# EAGLE design base1 (EAGLE 7.2.0)
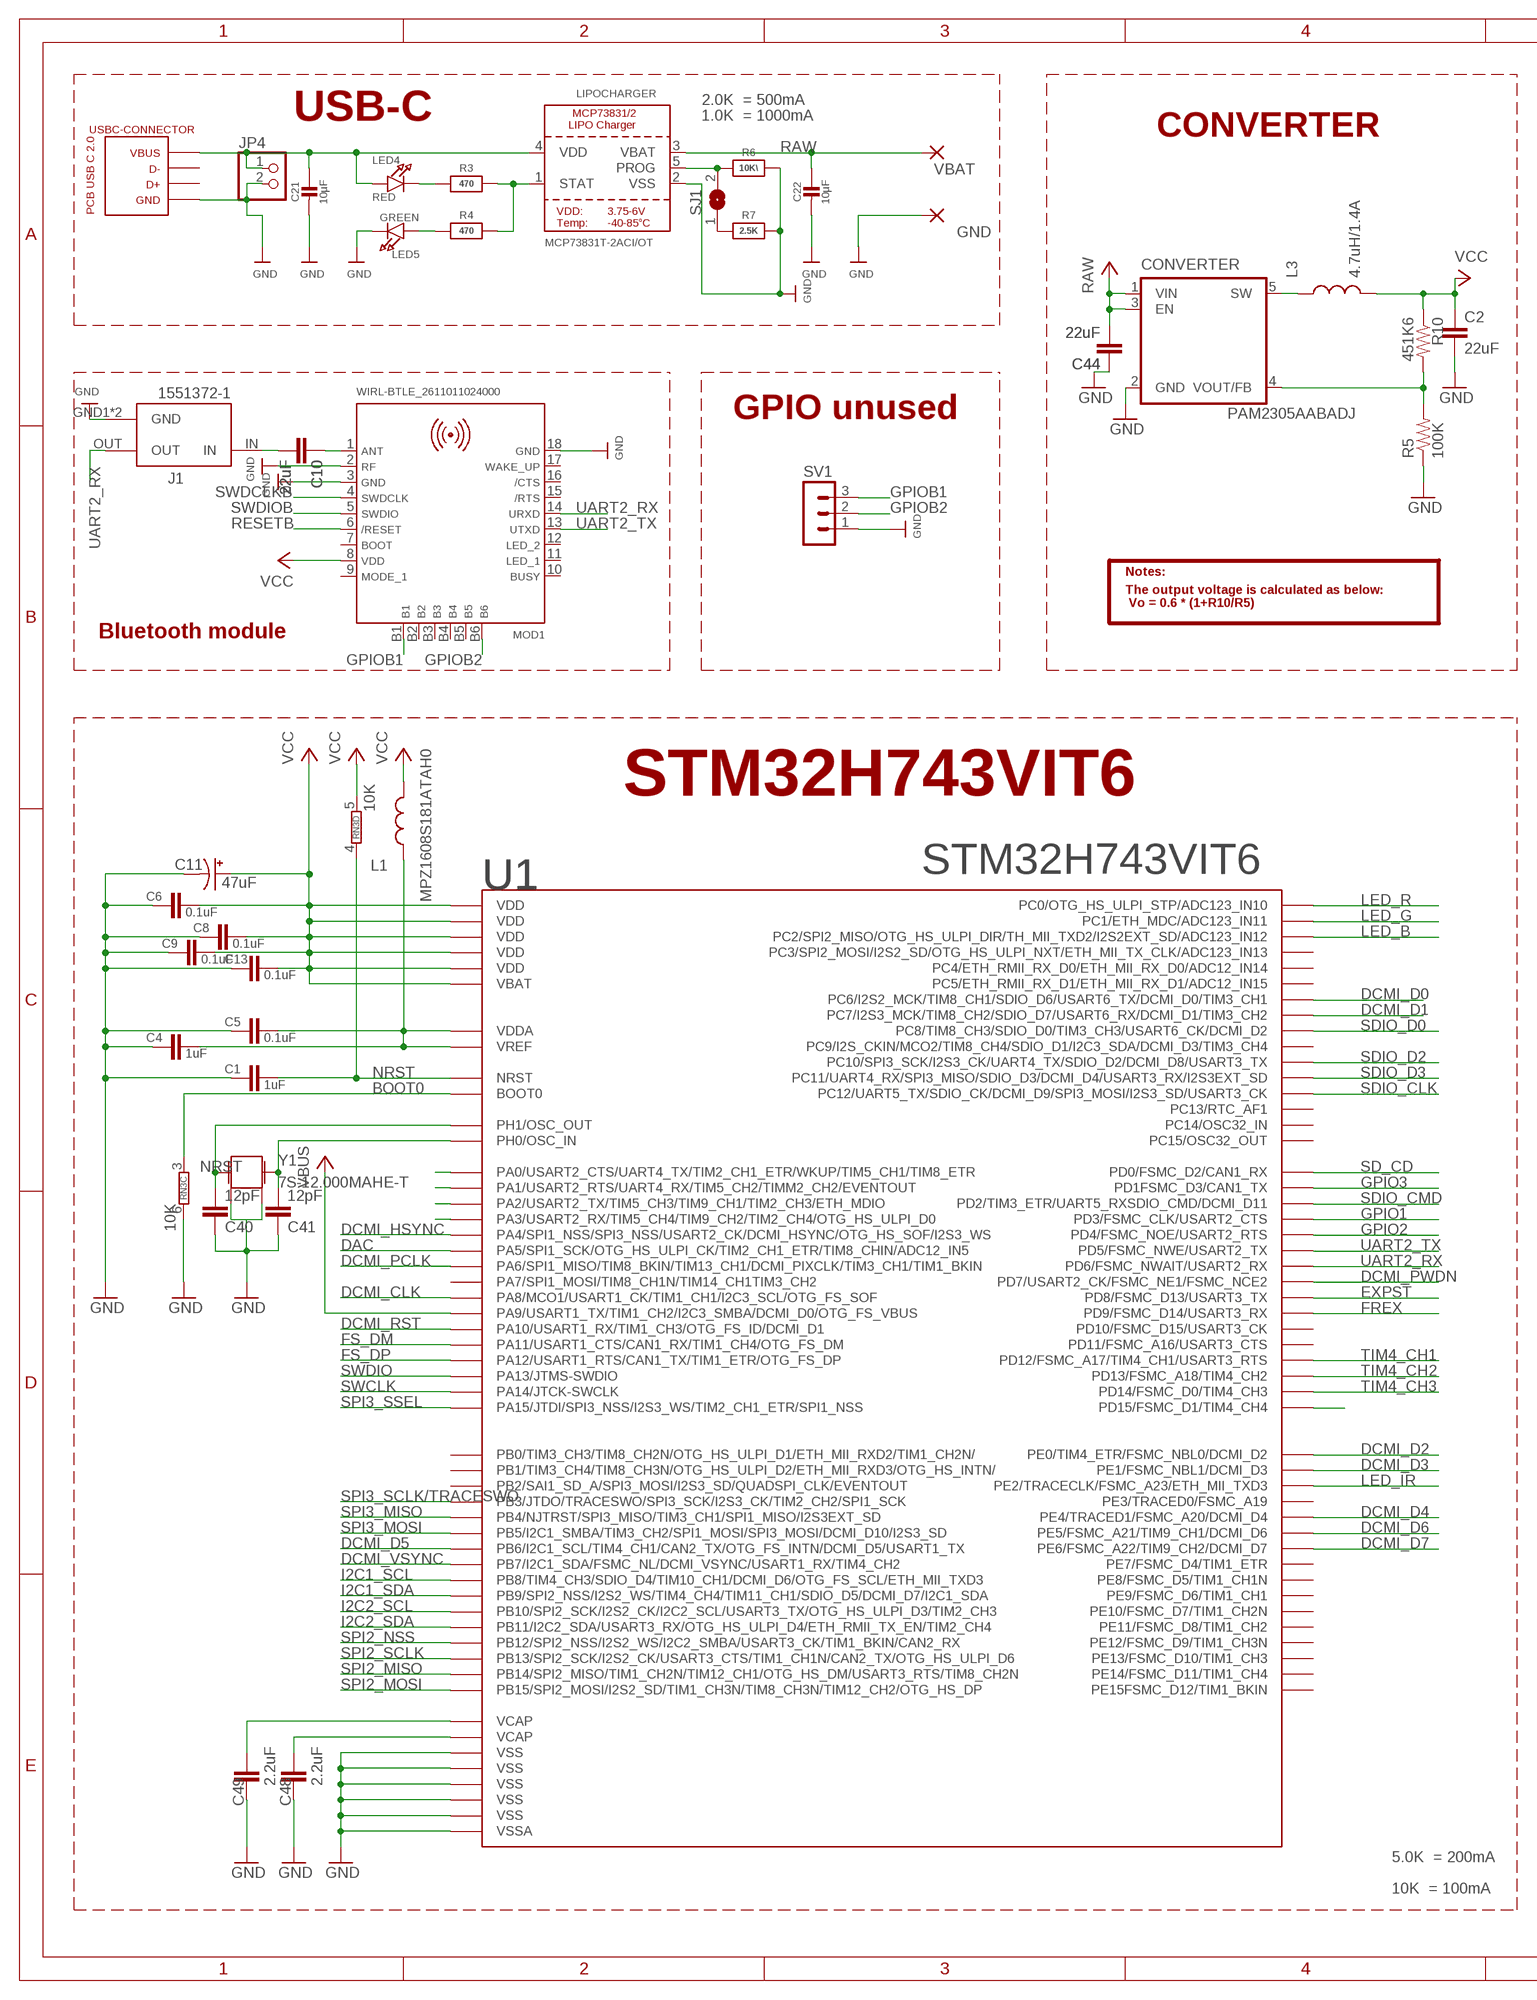
[diagram p0: schematic, sheet 1, part 1 of 2]
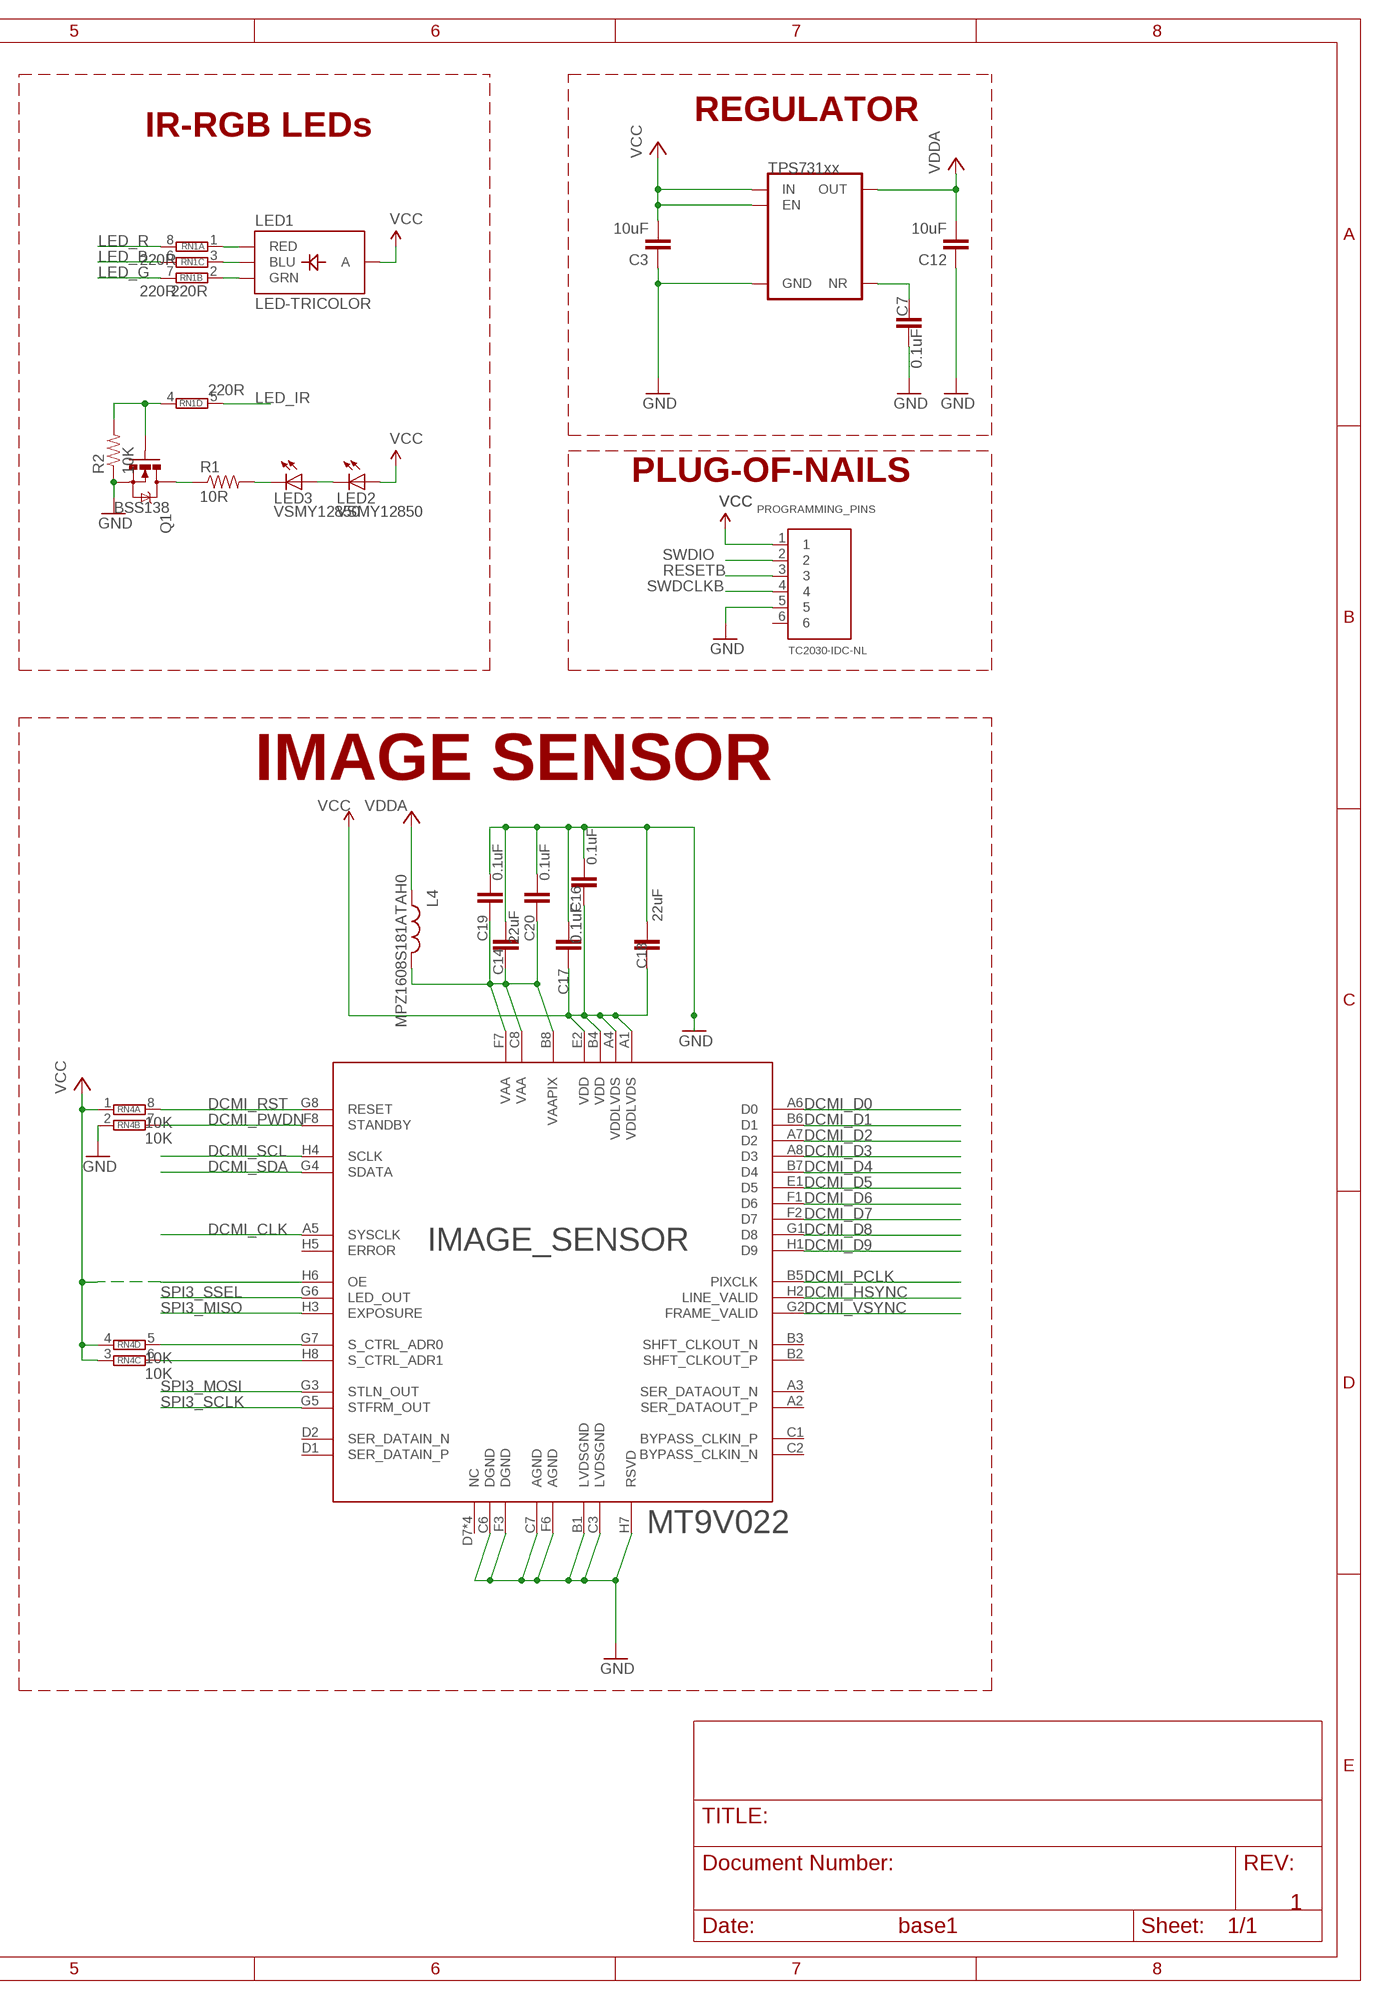
[diagram p1: schematic, sheet 1, part 2 of 2]

## Parts
C1  1uF  CAP0603-CAP  [0603-CAP]
C2  22uF  CAP0805  [0805]
C3  10uF  CAP0805  [0805]
C4  1uF  CAP0603-CAP  [0603-CAP]
C5  0.1uF  CAP0603-CAP  [0603-CAP]
C6  0.1uF  CAP0603-CAP  [0603-CAP]
C7  0.1uF  CAP0603-CAP  [0603-CAP]
C8  0.1uF  CAP0603-CAP  [0603-CAP]
C9  0.1uF  CAP0603-CAP  [0603-CAP]
C10  22uF  CAP0805  [0805]
C11  47uF  CAP_POL1206  [EIA3216]
C12  10uF  CAP0805  [0805]
C13  0.1uF  CAP0603-CAP  [0603-CAP]
C14  22uF  CAP0805  [0805]
C16  0.1uF  CAP0402-CAP  [0402-CAP]
C17  0.1uF  CAP0402-CAP  [0402-CAP]
C18  22uF  CAP0805  [0805]
C19  0.1uF  CAP0402-CAP  [0402-CAP]
C20  0.1uF  CAP0402-CAP  [0402-CAP]
C21  10µF  CAP_CERAMIC0805-NOOUTLINE  [0805-NO]
C22  10µF  CAP_CERAMIC0805-NOOUTLINE  [0805-NO]
C40  12pF  CAP0603-CAP  [0603-CAP]
C41  12pF  CAP0603-CAP  [0603-CAP]
C44  22uF  CAP0805  [0805]
C48  2.2uF  CAP0603-CAP  [0603-CAP]
C49  2.2uF  CAP0603-CAP  [0603-CAP]
CONVERTER  PAM2305AABADJ  PAM2305AAB330  [TSOT25]
GND  SMD2  [SMD1,27-2,54]
IMAGE_SENSOR  MT9V022  [IBGA52]
J1  1551372-1  [TE_1551372-1]
JP4  HEADER-1X2ROUND  [1X02_ROUND]
L1  MPZ1608S181ATAH0  INDUCTOR0603  [0603]
L3  4.7uH/1.4A  INDUCTOR1007  [1007]
L4  MPZ1608S181ATAH0  INDUCTOR0603  [0603]
LED1  LED-TRICOLOR  [LED-TRICOLOR-SMD-MF]
LED2  VSMY12850  LED1206  [LED-1206]
LED3  VSMY12850  LED1206  [LED-1206]
LED4  RED  LED0805_NOOUTLINE  [CHIPLED_0805_NOOUTLINE]
LED5  GREEN  LED0805_NOOUTLINE  [CHIPLED_0805_NOOUTLINE]
LIPOCHARGER  MCP73831T-2ACI/OT  MCP73831/2  [SOT23-5]
MOD1  WIRL-BTLE_2611011024000  [WE-FP-4+]
PROGRAMMING_PINS  TC2030-IDC-NL  [TAG_TC2030-IDC-NL]
Q1  BSS138  MOSFET-NCHANNELSMD  [SOT23-3]
R1  10R  RESISTOR0603-RES  [0603-RES]
R2  10K  RESISTOR0603-RES  [0603-RES]
R3  470  RESISTOR0805_NOOUTLINE  [0805-NO]
R4  470  RESISTOR0805_NOOUTLINE  [0805-NO]
R5  100K  RESISTOR0603-RES  [0603-RES]
R6  10K\  RESISTOR0805_NOOUTLINE  [0805-NO]
R7  2.5K  RESISTOR0805_NOOUTLINE  [0805-NO]
R10  451K6  RESISTOR0603-RES  [0603-RES]
REGULATOR  TPS731XX  [SOT23-5]
RN1  220R  4R-NEXBV8V  [EXBV8V]
RN3  10K  4R-NEXBV8V  [EXBV8V]
RN4  10K  4R-NEXBV8V  [EXBV8V]
SJ1  SOLDERJUMPER  [SOLDERJUMPER_ARROW_NOPASTE]
SV1  MA03-1  [MA03-1]
U1  STM32H743VIT6  STM32F746LQFP100  [LQFP100]
USBC-CONNECTOR  PCB_USB_C_2.0DS_2  [USB_TYPE_C_DS_2]
VBAT  SMD2  [SMD1,27-2,54]
Y1  7S-12.000MAHE-T  CRYSTAL2.5X2.0  [CRYSTAL-2.5X2.0]

## Nets
BOOT0: RN3.3 U1.94(BOOT0)
DAC: U1.29(PA5/SPI1_SCK/OTG_HS_ULPI_CK/TIM2_CH1_ETR/TIM8_CHIN/ADC12_IN5)
DCMI_CLK: IMAGE_SENSOR.A5(SYSCLK) U1.67(PA8/MCO1/USART1_CK/TIM1_CH1/I2C3_SCL/OTG_FS_SOF)
DCMI_D0: IMAGE_SENSOR.A6(D0) U1.63(PC6/I2S2_MCK/TIM8_CH1/SDIO_D6/USART6_TX/DCMI_D0/TIM3_CH1)
DCMI_D1: IMAGE_SENSOR.B6(D1) U1.64(PC7/I2S3_MCK/TIM8_CH2/SDIO_D7/USART6_RX/DCMI_D1/TIM3_CH2)
DCMI_D2: IMAGE_SENSOR.A7(D2) U1.97(PE0/TIM4_ETR/FSMC_NBL0/DCMI_D2)
DCMI_D3: IMAGE_SENSOR.A8(D3) U1.98(PE1/FSMC_NBL1/DCMI_D3)
DCMI_D4: IMAGE_SENSOR.B7(D4) U1.3(PE4/TRACED1/FSMC_A20/DCMI_D4)
DCMI_D5: IMAGE_SENSOR.E1(D5) U1.92(PB6/I2C1_SCL/TIM4_CH1/CAN2_TX/OTG_FS_INTN/DCMI_D5/USART1_TX)
DCMI_D6: IMAGE_SENSOR.F1(D6) U1.4(PE5/FSMC_A21/TIM9_CH1/DCMI_D6)
DCMI_D7: IMAGE_SENSOR.F2(D7) U1.5(PE6/FSMC_A22/TIM9_CH2/DCMI_D7)
DCMI_D8: IMAGE_SENSOR.G1(D8)
DCMI_D9: IMAGE_SENSOR.H1(D9)
DCMI_HSYNC: IMAGE_SENSOR.H2(LINE_VALID) U1.28(PA4/SPI1_NSS/SPI3_NSS/USART2_CK/DCMI_HSYNC/OTG_HS_SOF/I2S3_WS)
DCMI_PCLK: IMAGE_SENSOR.B5(PIXCLK) U1.30(PA6/SPI1_MISO/TIM8_BKIN/TIM13_CH1/DCMI_PIXCLK/TIM3_CH1/TIM1_BKIN)
DCMI_PWDN: IMAGE_SENSOR.F8(STANDBY) RN4.7 U1.88(PD7/USART2_CK/FSMC_NE1/FSMC_NCE2)
DCMI_RST: IMAGE_SENSOR.G8(RESET) RN4.8 U1.69(PA10/USART1_RX/TIM1_CH3/OTG_FS_ID/DCMI_D1)
DCMI_SCL: IMAGE_SENSOR.H4(SCLK)
DCMI_SDA: IMAGE_SENSOR.G4(SDATA)
DCMI_VSYNC: IMAGE_SENSOR.G2(FRAME_VALID) U1.93(PB7/I2C1_SDA/FSMC_NL/DCMI_VSYNC/USART1_RX/TIM4_CH2)
EXPST: U1.55(PD8/FSMC_D13/USART3_TX)
FREX: U1.56(PD9/FSMC_D14/USART3_RX)
FS_DM: U1.70(PA11/USART1_CTS/CAN1_RX/TIM1_CH4/OTG_FS_DM)
FS_DP: U1.71(PA12/USART1_RTS/CAN1_TX/TIM1_ETR/OTG_FS_DP)
GND: C1.2 C2.2 C3.1 C4.2 C5.2 C6.2 C7.2 C8.2 C9.2 C11.C(-) C12.1 C13.2 C14.1 C16.2 C17.2 C18.1 C19.2 C20.2 C21.2 C22.2 C40.1 C41.1 C44.1 C48.2 C49.2 CONVERTER.2(GND) GND.1(P) IMAGE_SENSOR.B1(LVDSGND) IMAGE_SENSOR.C3(LVDSGND) IMAGE_SENSOR.C6(DGND) IMAGE_SENSOR.C7(AGND) IMAGE_SENSOR.F3(DGND) IMAGE_SENSOR.F6(AGND) IMAGE_SENSOR.H7(RSVD) J1.GND1(GND) J1.GND2(GND) JP4.2 LED5.C LIPOCHARGER.2(VSS) MOD1.2 MOD1.3 MOD1.18 PROGRAMMING_PINS.5 Q1.2(S) R2.1 R5.1 R6.2 R7.2 REGULATOR.2(GND) RN3.6 RN4.2 SV1.1 U1.10(VSS) U1.19(VSSA) U1.26(VSS) U1.49(VSS) U1.74(VSS) U1.99(VSS) USBC-CONNECTOR.A4(VBUS) USBC-CONNECTOR.A9(VBUS) USBC-CONNECTOR.B4(VBUS) USBC-CONNECTOR.B9(VBUS)
GPIO1: U1.84(PD3/FSMC_CLK/USART2_CTS)
GPIO2: U1.85(PD4/FSMC_NOE/USART2_RTS)
GPIO3: U1.82(PD1FSMC_D3/CAN1_TX)
GPIOB1: MOD1.B1 SV1.3
GPIOB2: MOD1.B6 SV1.2
I2C1_SCL: U1.95(PB8/TIM4_CH3/SDIO_D4/TIM10_CH1/DCMI_D6/OTG_FS_SCL/ETH_MII_TXD3)
I2C1_SDA: U1.96(PB9/SPI2_NSS/I2S2_WS/TIM4_CH4/TIM11_CH1/SDIO_D5/DCMI_D7/I2C1_SDA)
I2C2_SCL: U1.46(PB10/SPI2_SCK/I2S2_CK/I2C2_SCL/USART3_TX/OTG_HS_ULPI_D3/TIM2_CH3)
I2C2_SDA: U1.47(PB11/I2C2_SDA/USART3_RX/OTG_HS_ULPI_D4/ETH_RMII_TX_EN/TIM2_CH4)
LED_B: RN1.6 U1.17(PC2/SPI2_MISO/OTG_HS_ULPI_DIR/TH_MII_TXD2/I2S2EXT_SD/ADC123_IN12)
LED_G: RN1.7 U1.16(PC1/ETH_MDC/ADC123_IN11)
LED_IR: RN1.5 U1.1(PE2/TRACECLK/FSMC_A23/ETH_MII_TXD3)
LED_R: RN1.8 U1.15(PC0/OTG_HS_ULPI_STP/ADC123_IN10)
N$1: LED4.C R3.1
N$2: C40.2 U1.13(PH1/OSC_OUT) Y1.3
N$3: LIPOCHARGER.1(STAT) R3.2 R4.2
N$4: C41.2 U1.12(PH0/OSC_IN) Y1.1
N$5: Q1.1(G) R2.2 RN1.4
N$6: LED1.B(BLU) RN1.3
N$7: C10.2 J1.IN
N$8: LED1.R(RED) RN1.1
N$9: LED1.G(GRN) RN1.2
N$10: LED3.C R1.2
N$11: C7.1 REGULATOR.4(NR)
N$12: C4.1 C5.1 L1.1 U1.20(VREF) U1.21(VDDA)
N$13: CONVERTER.4(VOUT/FB) R5.2 R10.2
N$14: Q1.3(D) R1.1
N$15: LIPOCHARGER.5(PROG) R6.1 SJ1.2
N$16: LED5.A R4.1
N$17: LED2.C LED3.A
N$18: R7.1 SJ1.1
N$19: IMAGE_SENSOR.G7(S_CTRL_ADR0) RN4.5
N$20: IMAGE_SENSOR.H8(S_CTRL_ADR1) RN4.6
N$21: C10.1 MOD1.1
N$30: U1.62(PD15/FSMC_D1/TIM4_CH4)
N$31: U1.22(PA0/USART2_CTS/UART4_TX/TIM2_CH1_ETR/WKUP/TIM5_CH1/TIM8_ETR)
N$32: U1.23(PA1/USART2_RTS/UART4_RX/TIM5_CH2/TIMM2_CH2/EVENTOUT)
N$33: U1.24(PA2/USART2_TX/TIM5_CH3/TIM9_CH1/TIM2_CH3/ETH_MDIO)
N$34: U1.25(PA3/USART2_RX/TIM5_CH4/TIM9_CH2/TIM2_CH4/OTG_HS_ULPI_D0)
NRST: C1.1 RN3.4 U1.14(NRST)
P$1: Y1.2 Y1.4
RAW: C22.1 C44.2 CONVERTER.1(VIN) CONVERTER.3(EN) LIPOCHARGER.3(VBAT) VBAT.1(P)
RESETB: MOD1.6 PROGRAMMING_PINS.3
SD_CD: U1.81(PD0/FSMC_D2/CAN1_RX)
SDIO_CLK: U1.80(PC12/UART5_TX/SDIO_CK/DCMI_D9/SPI3_MOSI/I2S3_SD/USART3_CK)
SDIO_CMD: U1.83(PD2/TIM3_ETR/UART5_RXSDIO_CMD/DCMI_D11)
SDIO_D0: U1.65(PC8/TIM8_CH3/SDIO_D0/TIM3_CH3/USART6_CK/DCMI_D2)
SDIO_D2: U1.78(PC10/SPI3_SCK/I2S3_CK/UART4_TX/SDIO_D2/DCMI_D8/USART3_TX)
SDIO_D3: U1.79(PC11/UART4_RX/SPI3_MISO/SDIO_D3/DCMI_D4/USART3_RX/I2S3EXT_SD)
SPI2_MISO: U1.53(PB14/SPI2_MISO/TIM1_CH2N/TIM12_CH1/OTG_HS_DM/USART3_RTS/TIM8_CH2N)
SPI2_MOSI: U1.54(PB15/SPI2_MOSI/I2S2_SD/TIM1_CH3N/TIM8_CH3N/TIM12_CH2/OTG_HS_DP)
SPI2_NSS: U1.51(PB12/SPI2_NSS/I2S2_WS/I2C2_SMBA/USART3_CK/TIM1_BKIN/CAN2_RX)
SPI2_SCLK: U1.52(PB13/SPI2_SCK/I2S2_CK/USART3_CTS/TIM1_CH1N/CAN2_TX/OTG_HS_ULPI_D6)
SPI3_MISO: IMAGE_SENSOR.H3(EXPOSURE) U1.90(PB4/NJTRST/SPI3_MISO/TIM3_CH1/SPI1_MISO/I2S3EXT_SD)
SPI3_MOSI: IMAGE_SENSOR.G3(STLN_OUT) U1.91(PB5/I2C1_SMBA/TIM3_CH2/SPI1_MOSI/SPI3_MOSI/DCMI_D10/I2S3_SD)
SPI3_SCLK: IMAGE_SENSOR.G5(STFRM_OUT)
SPI3_SCLK/TRACESWO: U1.89(PB3/JTDO/TRACESWO/SPI3_SCK/I2S3_CK/TIM2_CH2/SPI1_SCK)
SPI3_SSEL: IMAGE_SENSOR.G6(LED_OUT) U1.77(PA15/JTDI/SPI3_NSS/I2S3_WS/TIM2_CH1_ETR/SPI1_NSS)
SW: CONVERTER.5(SW) L3.1
SWCLK: U1.76(PA14/JTCK-SWCLK)
SWDCLKB: MOD1.4 PROGRAMMING_PINS.4
SWDIO: PROGRAMMING_PINS.2 U1.72(PA13/JTMS-SWDIO)
SWDIOB: MOD1.5
TIM4_CH1: U1.59(PD12/FSMC_A17/TIM4_CH1/USART3_RTS)
TIM4_CH2: U1.60(PD13/FSMC_A18/TIM4_CH2)
TIM4_CH3: U1.61(PD14/FSMC_D0/TIM4_CH3)
UART2_RX: J1.OUT MOD1.14 U1.87(PD6/FSMC_NWAIT/USART2_RX)
UART2_TX: MOD1.13 U1.86(PD5/FSMC_NWE/USART2_TX)
VAA: C14.2 C19.1 C20.1 IMAGE_SENSOR.B8(VAAPIX) IMAGE_SENSOR.C8(VAA) IMAGE_SENSOR.F7(VAA) L4.2
VBAT: C2.1 C3.2 C6.1 C8.1 C9.1 C11.A(+) C13.1 C16.1 C17.1 C18.2 IMAGE_SENSOR.A1(VDDLVDS) IMAGE_SENSOR.A4(VDDLVDS) IMAGE_SENSOR.B4(VDD) IMAGE_SENSOR.E2(VDD) IMAGE_SENSOR.H6(OE) L1.2 L3.2 LED1.A LED2.A R10.1 REGULATOR.1(IN) REGULATOR.3(EN) RN3.5 RN4.1 RN4.3 RN4.4 U1.6(VBAT) U1.11(VDD) U1.27(VDD) U1.50(VDD) U1.75(VDD) U1.100(VDD) ; supply symbol labelled VCC
VBUS: U1.68(PA9/USART1_TX/TIM1_CH2/I2C3_SMBA/DCMI_D0/OTG_FS_VBUS)
VCAP1: C49.1 U1.48(VCAP)
VCAP2: C48.1 U1.73(VCAP)
VCC: MOD1.8 PROGRAMMING_PINS.1
VDD: C21.1 JP4.1 LED4.A LIPOCHARGER.4(VDD) USBC-CONNECTOR.A1(GND) USBC-CONNECTOR.A12(GND) USBC-CONNECTOR.B1(GND) USBC-CONNECTOR.B12(GND)
VDDA: C12.2 L4.1 REGULATOR.5(OUT)
Unconnected: IMAGE_SENSOR.A2(SER_DATAOUT_P) IMAGE_SENSOR.A3(SER_DATAOUT_N) IMAGE_SENSOR.B2(SHFT_CLKOUT_P) IMAGE_SENSOR.B3(SHFT_CLKOUT_N) IMAGE_SENSOR.C1(BYPASS_CLKIN_P) IMAGE_SENSOR.C2(BYPASS_CLKIN_N) IMAGE_SENSOR.D1(SER_DATAIN_P) IMAGE_SENSOR.D2(SER_DATAIN_N) IMAGE_SENSOR.D7(NC) IMAGE_SENSOR.D8(NC) IMAGE_SENSOR.E7(NC) IMAGE_SENSOR.E8(NC) IMAGE_SENSOR.H5(ERROR) MOD1.7 MOD1.9 MOD1.10 MOD1.11 MOD1.12 MOD1.15 MOD1.16 MOD1.17 MOD1.B2 MOD1.B3 MOD1.B4 MOD1.B5 PROGRAMMING_PINS.6 RN3.1 RN3.2 RN3.7 RN3.8 U1.2(PE3/TRACED0/FSMC_A19) U1.7(PC13/RTC_AF1) U1.8(PC14/OSC32_IN) U1.9(PC15/OSC32_OUT) U1.18(PC3/SPI2_MOSI/I2S2_SD/OTG_HS_ULPI_NXT/ETH_MII_TX_CLK/ADC123_IN13) U1.31(PA7/SPI1_MOSI/TIM8_CH1N/TIM14_CH1TIM3_CH2) U1.32(PC4/ETH_RMII_RX_D0/ETH_MII_RX_D0/ADC12_IN14) U1.33(PC5/ETH_RMII_RX_D1/ETH_MII_RX_D1/ADC12_IN15) U1.34(PB0/TIM3_CH3/TIM8_CH2N/OTG_HS_ULPI_D1/ETH_MII_RXD2/TIM1_CH2N/) U1.35(PB1/TIM3_CH4/TIM8_CH3N/OTG_HS_ULPI_D2/ETH_MII_RXD3/OTG_HS_INTN/) U1.36(PB2/SAI1_SD_A/SPI3_MOSI/I2S3_SD/QUADSPI_CLK/EVENTOUT) U1.37(PE7/FSMC_D4/TIM1_ETR) U1.38(PE8/FSMC_D5/TIM1_CH1N) U1.39(PE9/FSMC_D6/TIM1_CH1) U1.40(PE10/FSMC_D7/TIM1_CH2N) U1.41(PE11/FSMC_D8/TIM1_CH2) U1.42(PE12/FSMC_D9/TIM1_CH3N) U1.43(PE13/FSMC_D10/TIM1_CH3) U1.44(PE14/FSMC_D11/TIM1_CH4) U1.45(PE15FSMC_D12/TIM1_BKIN) U1.57(PD10/FSMC_D15/USART3_CK) U1.58(PD11/FSMC_A16/USART3_CTS) U1.66(PC9/I2S_CKIN/MCO2/TIM8_CH4/SDIO_D1/I2C3_SDA/DCMI_D3/TIM3_CH4) USBC-CONNECTOR.A6(D+) USBC-CONNECTOR.A7(D-) USBC-CONNECTOR.B6(D+) USBC-CONNECTOR.B7(D-)

## Notes on the sheet
- 2.0K  = 500mA
- USB-C | 1.0K  = 1000mA | REGULATOR
- CONVERTER | IR-RGB LEDs
- GPIO unused
- PLUG-OF-NAILS
- Notes:
- The output voltage is calculated as below:
   Vo = 0.6 * (1+R10/R5)
- Bluetooth module
- STM32H743VIT6 | IMAGE SENSOR
- 5.0K  = 200mA
- 10K  = 100mA
- 1

## Library data of the parts
C1-C10 C12-C14 C16-C20 C40 C41 C44 C48 C49 = sfe:CAP: Capacitor Standard 0603 ceramic capacitor, and 0.1" leaded capacitor.
C11 = sfe:CAP_POL: Capacitor Polarized These are standard SMD and PTH capacitors. Normally 10uF, 47uF, and 100uF in electrolytic and tantalum varieties. Always verify the external diameter of the through hole cap, it varies with capacity, voltage, and manufacturer. The EIA devices should be standard.
C21 C22 = microbuilder:CAP_CERAMIC: Ceramic Capacitors For new designs, use the packages preceded by an '_' character since they are more reliable: The following footprints should be used on most boards: _0402 - Standard footprint for regular board layouts _0603 - Standard footprint for regular board layouts _0805 - Standard footprint for regular board layouts _1206 - Standard footprint for regular board layouts For extremely tight-pitch boards where space is at a premium, the following 'micro-pitch' footprints can be used (smaller pads, no silkscreen outline, etc.): _0402MP - Micro-pitch footprint for very dense/compact boards _0603MP - Micro-pitch footprint for very dense/compact boards _0805MP - Micro-pitch footprint for very dense/compact boards _1206MP - Micro-pitch footprint for very dense/compact boards
CONVERTER = regulators:PAM2305AAB330
GND VBAT = wirepad:SMD2: SMD PAD
IMAGE_SENSOR = MT9V022:MT9V022
J1 = 1551372-1:1551372-1: CONN COAX SWITCH JACK STR 50OHM Check availability <https://pricing.snapeda.com/parts/1551372-1/TE%20Connectivity/view-part?ref=eda>; AVAILABILITY: In Stock; CHECK_PRICES: https://www.snapeda.com/parts/1551372-1/TE+Connectivity+AMP+Connectors/view-part/?ref=eda; DESCRIPTION: Coaxial Switch - 1.35mm Plug Dia Connector Jack, Female Socket 50 Ohms Surface Mount Solder; MF: TE Connectivity; MP: 1551372-1; PACKAGE: None; PRICE: None; SNAPEDA_LINK: https://www.snapeda.com/parts/1551372-1/TE+Connectivity+AMP+Connectors/view-part/?ref=snap
JP4 = microbuilder:HEADER-1X2: PIN HEADER
L1 L3 L4 = sfe:INDUCTOR: Inductors Basic Inductor/Choke - 0603 and 1206. Footprints are not proven and vary greatly between part numbers.
LED1 = sfe:LED-TRICOLOR: Tri-Color LED SMD Proven layout and schematic for triple color LED in SMD package - common anode. Spark Fun Electronics SKU : COM-07844
LED2 LED3 = sfe:LED: LEDs Standard schematic elements and footprints for 5mm, 3mm, 1206, and 0603 sized LEDs. 5mm - Spark Fun Electronics SKU : COM-00529 (and others)
LED4 LED5 = microbuilder:LED: LED 0603 - 0603 Surface Mount Package 2mA: Green LED - Low Power (3.9mcd, 2ma, 1.7Vf) - Digikey: 475-2709-2-ND Orange LED - Low Power (9.8mcd, 2ma, 1.8Vf) - Digikey: 475-1194-2-ND Red LED - Low Power (5mcd, 2ma, 1.8Vf) - Digikey: 475-1195-2-ND Yellow LED - Low Power (7mcd, 2ma, 1.8Vf) - Digikey: 475-1196-2-ND 5mA: Blue LED - Low Power (17mcd, 5ma, 2.9Vf) - Digikey: LNJ937W8CRACT-ND 0805 - 0805 Surface Mount Package 2mA: Red LED (8.8mcd, 2mA, 1.8Vf, Clear) - Low Power [Digikey: 475-2510-1-ND] Green LED (5mcd, 2mA, 1.8Vf, Clear) - Low Power [Digikey: 475-2730-1-ND] Yellow LED (11.3mcd, 2mA, 1.8Vf, Clear) - Low Power [Digikey: 475-2555-1-ND] 20mA: Red LED (104mcd, 20mA, Diffused) - LS R976 [Digikey: 475-1278-6-ND] Red LED (12mcd, 20mA, 2.0Vf, Clear) - APT2012EC [Digikey: 754-1128-1-ND] Green LED (15mcd, 20mA, 2.2Vf, Clear) - APT2012GC [Digikey: 754-1131-1-ND] Orange LED (160mcd, 20mA, 2.1Vf, Clear) - APT2012SECK [Digikey: 754-1130-1-ND] 1206 - 1206 Surface Mount Package Green LED (26mcd, 20mA, Diffused) - LG N971 [Digikey: 475-1407-6-ND] Red LED (15mcd, 20mA, Diffused) - LH N974 [Digikey: 475-1416-6-ND] Cree - Cree High-Power Surface Mount LEDs XPEBWT-L1-0000-00D50 - White 111lm 350mA 2.9Vf 6200K 110° XTEAWT-00-0000-00000LEE3 - White 114lm 350mA 2.85Vf 5000K 115° Everlight - Everlight 45-21 Series Surface Mount LEDs 45-21/QK2C-B2832AC2CB2/2T - Warm White 2000mcd 20mA 3.25Vf 3050K 120° 45-21/LK2C-B38452C4CB2/2T - Nuetral White 2000mcd 20mA 3.25Vf 4150K 120° 45-21/LK2C-B50634C6CB2/2T - Cold White 2200mcd 20mA 3.25Vf 5650K 120° PLCC2 Reverse Mount LS T77K-J1L2-1-0-2-R18-Z - Red 11.25mcd 2mA 1.8Vf 630nm 120° LO T77K-L1M2-24-Z - Orange 19.6mcd 2mA 1.8Vf 606nm 120° LY T77K-K2M1-26-Z - Yellow 15.7mcd 2mA 1.8Vf 587nm 120°
LIPOCHARGER = microbuilder:MCP73831/2: MCP73831/2 LIPO Charger VDD: 3.75 - 6V Temp -40 - 85°C Programmable Charge Rate: 15-500mA NOTE: STAT is a tri-state logic output on the MCP73831 and an open-drain output on the MCP73832. SOT23-5 with 4.2V output and tri-state logic on STAT = MCP73831T-2ACI/OT
MOD1 = WE_WIRL_Rev13.0:WIRL-BTLE_2611011024000: Proteus-III - Bluetooth® LE 5.1 Module WIRL-BTLE Bluetooth® LE 5.1 Module Details see: https://we-online.de/katalog/en/article/2611011024000/; HEIGHT: 2mm; MANUFACTURER: Würth Elektronik; NR: 2611011024000
PROGRAMMING_PINS = TC2030-IDC-NL:TC2030-IDC-NL: CABLE ADAPTER 6 POS Check availability <https://pricing.snapeda.com/parts/TC2030-IDC-NL/Tag-Connect/view-part?ref=eda>; AVAILABILITY: Not in stock; CHECK_PRICES: https://www.snapeda.com/parts/TC2030-IDC-NL/Tag-Connect/view-part/?ref=eda; DESCRIPTION: PLUG-OF-NAILS 6-PIN W/O LEGS 8; MF: Tag-Connect; MP: TC2030-IDC-NL; PACKAGE: None; PRICE: None; SNAPEDA_LINK: https://www.snapeda.com/parts/TC2030-IDC-NL/Tag-Connect/view-part/?ref=snap
Q1 = sfe:MOSFET-NCHANNEL
R1 R2 R5 R10 = sfe:RESISTOR: Resistor Basic schematic elements and footprints for 0603, 1206, and PTH resistors.
R3 R4 R6 R7 = microbuilder:RESISTOR: Resistors For new designs, use the packages preceded by an '_' character since they are more reliable: The following footprints should be used on most boards: _0402 - Standard footprint for regular board layouts _0603 - Standard footprint for regular board layouts _0805 - Standard footprint for regular board layouts _1206 - Standard footprint for regular board layouts For extremely tight-pitch boards where space is at a premium, the following 'micro-pitch' footprints can be used (smaller pads, no silkscreen outline, etc.): _0402MP - Micro-pitch footprint for very dense/compact boards _0603MP - Micro-pitch footprint for very dense/compact boards _0805MP - Micro-pitch footprint for very dense/compact boards _1206MP - Micro-pitch footprint for very dense/compact boards
REGULATOR = mux:TPS731XX
RN1 RN3 RN4 = resistor-dil:4R-N: Array Chip Resistor Source: RS Component / Phycomp; OC_FARNELL: unknown; OC_NEWARK: unknown
SJ1 = microbuilder:SOLDERJUMPER: SMD Solder JUMPER Solder the two pads together to create a connection, or remove the solder to break it. REFLOW - Use this footprint for solder paste and reflow ovens. WAVE - Use this footprint for hand-soldering (larger pads). CLOSED - Has a trace between the two pads to ensure it is closed by default. The trace needs to be cut to disable the jumper, and can be closed again by creating a solder bridge between the two pads.; BOM: EXCLUDE
SV1 = con-lstb:MA03-1: PIN HEADER; OC_FARNELL: unknown; OC_NEWARK: unknown
U1 = stm32:STM32F746
USBC-CONNECTOR = USB_pcb_connectors:PCB_USB_C_2.0
Y1 = mux:CRYSTAL: Crystals Various standard crystals. Proven footprints. Spark Fun Electronics SKU : COM-00534

## Net classes
0 GND: width 0.002 mm, drill 0 mm

## Board
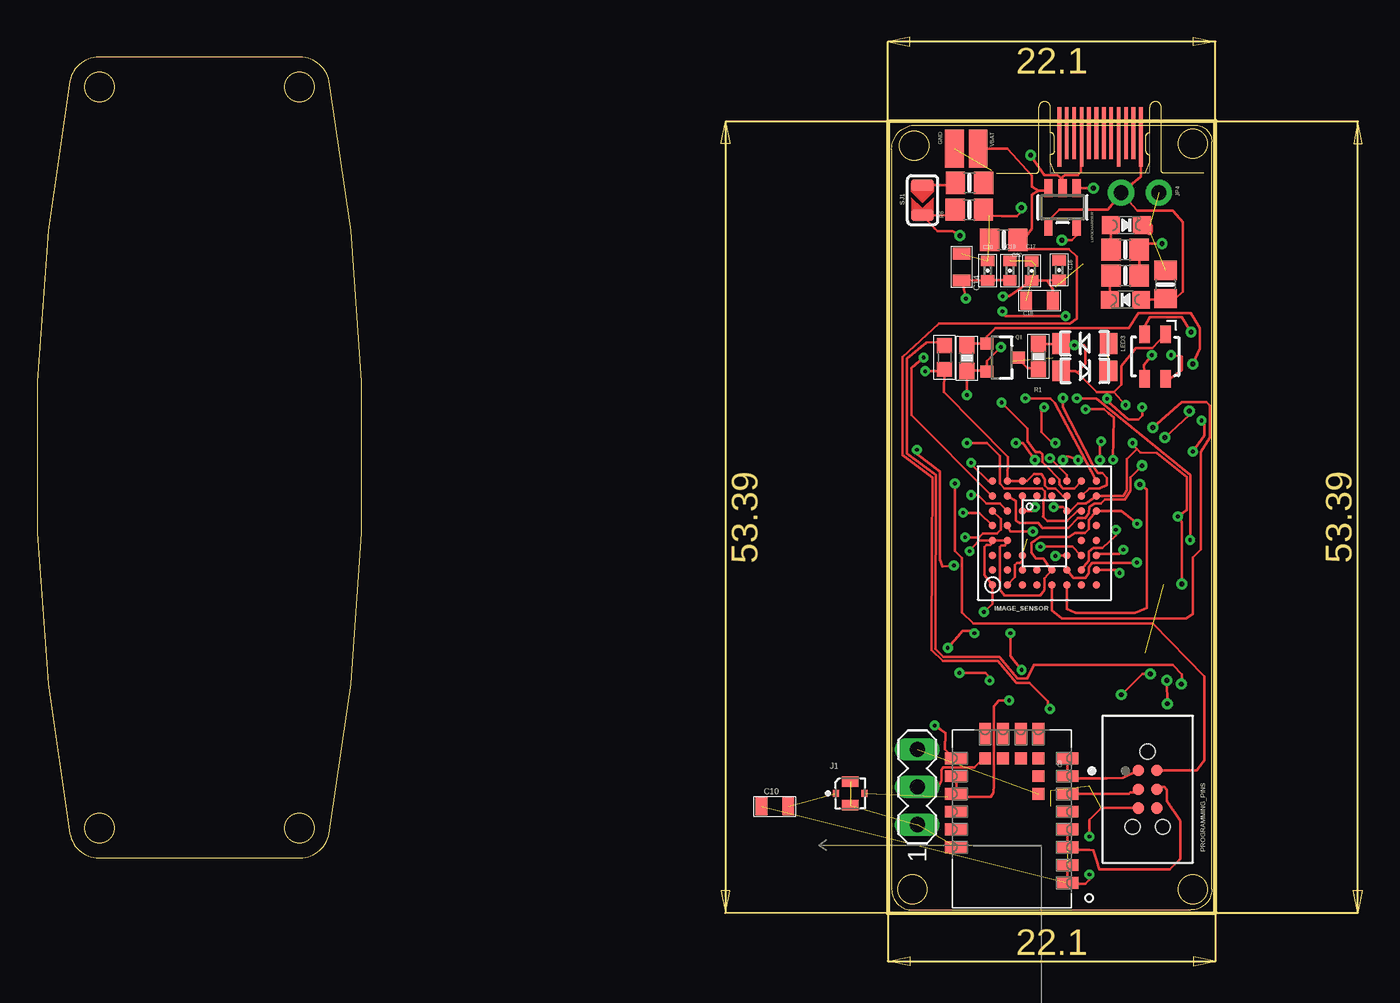
[diagram p2: board, top side]
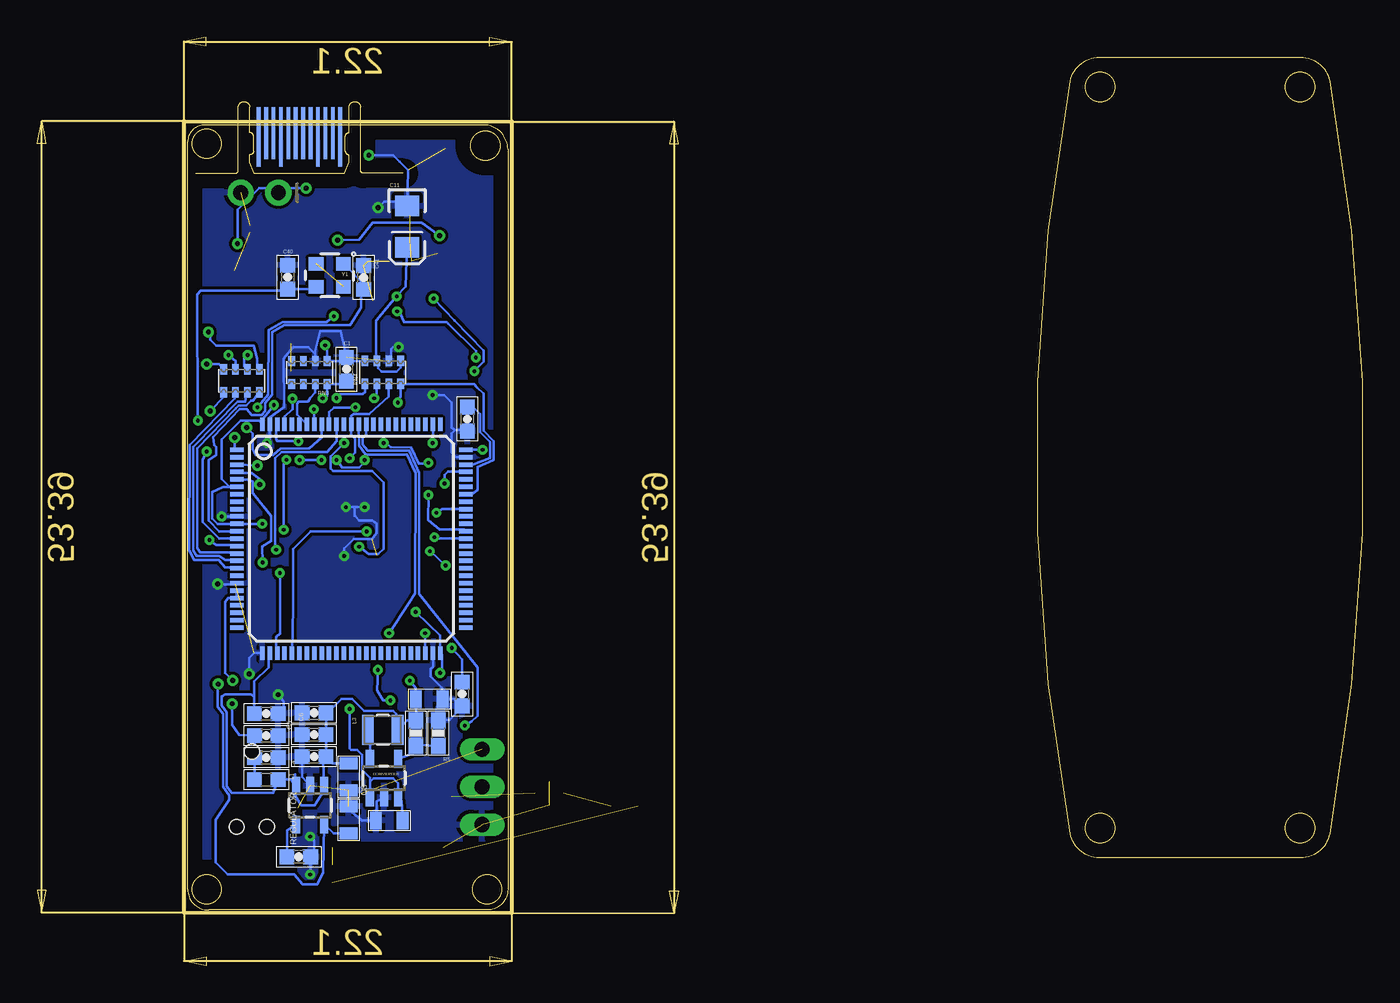
[diagram p3: board, bottom side, seen from below]

Size 79.48 x 57.73 mm. Coordinates in mm from the lower left corner, seen from the top.
Outline: 57.37,0 79.47,0.03 79.48,53.42 57.38,53.39 57.37,0
Outline: 4.17,3.73 17.74,3.73 arc79 19.7,5.34 arc21 19.7,56.13 arc79 17.74,57.73 4.17,57.73 arc79 2.21,56.13 arc21 2.21,5.34 arc79 4.17,3.73
Outline: 59.29,53.16 78.09,53.16 arc-90 79.23,52.02 79.23,1.6 arc-90 77.83,0.2 59.04,0.2 arc-90 57.64,1.6 57.64,51.51 arc-90 59.29,53.16
Outline: circle at 17.7,5.73 radius 1
Outline: circle at 17.7,55.73 radius 1
Outline: circle at 4.2,55.73 radius 1
Outline: circle at 4.2,5.73 radius 1
Outline: circle at 77.96,1.6 radius 0.99
Outline: circle at 59.04,1.6 radius 0.99
Outline: circle at 59.16,51.77 radius 0.99
Outline: circle at 77.96,51.89 radius 0.99
Copper layers (1*16): Top 0.035mm / dielectric 1.5mm / Bottom 0.035mm
Design rules "default": minimum track width 10mil, minimum drill 24mil, track to track 8mil, track to pad 8mil, pad to pad 8mil, via to via 8mil, smd to smd 8mil, copper to edge 40mil, drill to drill 8mil, minimum pad ring 10mil, minimum via ring 8mil, stop-mask expansion 4mil, vias tented up to drill 0mil, thermal gap 10mil

### Footprints (pad centres in the part's own frame; a part is rotated, then mirrored left to right if it is on the bottom)
0603-CAP = smd 1 x 1: 1 -0.8,0; 2 0.8,0
0805 = smd 0.8 x 1.2: 1 -0.9,0; 2 0.9,0
EIA3216 = smd 1.4 x 1.6: A 1.4,0; C -1.4,0
0402-CAP = smd 0.7 x 0.9: 1 -0.65,0; 2 0.65,0
0805-NO = smd 1.3 x 1.5: 1 -0.95,0; 2 0.95,0
TSOT25 = smd 0.55 x 1.2: 1 -0.95,-1.3; 2 0,-1.3; 3 0.95,-1.3; 4 0.95,1.3; 5 -0.95,1.3
SMD1,27-2,54 = smd 1.27 x 2.54: 1 0,0
IBGA52 = smd 0.5 x 0.5: A1 -3.5,3.5; A2 -2.5,3.5; A3 -1.5,3.5; A4 -0.5,3.5; A5 0.5,3.5; A6 1.5,3.5; A7 2.5,3.5; A8 3.5,3.5; B1 -3.5,2.5; B2 -2.5,2.5; B3 -1.5,2.5; B4 -0.5,2.5; B5 0.5,2.5; B6 1.5,2.5; B7 2.5,2.5; B8 3.5,2.5; C1 -3.5,1.5; C2 -2.5,1.5; C3 -1.5,1.5; C6 1.5,1.5; C7 2.5,1.5; C8 3.5,1.5; D1 -3.5,0.5; D2 -2.5,0.5; D7 2.5,0.5; D8 3.5,0.5; E1 -3.5,-0.5; E2 -2.5,-0.5; E7 2.5,-0.5; E8 3.5,-0.5; F1 -3.5,-1.5; F2 -2.5,-1.5; F3 -1.5,-1.5; F6 1.5,-1.5; F7 2.5,-1.5; F8 3.5,-1.5; G1 -3.5,-2.5; G2 -2.5,-2.5; G3 -1.5,-2.5; G4 -0.5,-2.5; G5 0.5,-2.5; G6 1.5,-2.5; G7 2.5,-2.5; G8 3.5,-2.5; H1 -3.5,-3.5; H2 -2.5,-3.5; H3 -1.5,-3.5; H4 -0.5,-3.5; H5 0.5,-3.5; H6 1.5,-3.5; H7 2.5,-3.5; H8 3.5,-3.5
TE_1551372-1 = smd 1.1 x 0.7: GND1 0,0.8; GND2 0,-0.8 | smd 0.4 x 0.5: IN -0.95,0; OUT 0.95,0
1X02_ROUND = drill 1 pad 1.778: 1 -1.27,0; 2 1.27,0
0603 = smd 1 x 1: 1 -0.8,0; 2 0.8,0
1007 = smd 2 x 0.8: 1 0,1; 2 0,-1
LED-TRICOLOR-SMD-MF = smd 0.7 x 1.2: A 0.7,1.5; B 0.7,-1.5; G -0.7,-1.5; R -0.7,1.5
LED-1206 = smd 1.2 x 1.4: A -1.6,0; C 1.6,0
CHIPLED_0805_NOOUTLINE = smd 1.2 x 1.2: A 0,-1.05; C 0,1.05
SOT23-5 = smd 0.55 x 1.2: 1 -0.95,-1.3; 2 0,-1.3; 3 0.95,-1.3; 4 0.95,1.3; 5 -0.95,1.3
WE-FP-4+ = smd 0.8 x 1.5: 1 -4.3,-3.75; 2 -3.1,-3.75; 3 -1.9,-3.75; 4 -0.7,-3.75; 5 0.5,-3.75; 6 1.7,-3.75; 7 2.9,-3.75; 8 4.1,-3.75; 13 4.1,3.75; 14 2.9,3.75; 15 1.7,3.75; 16 0.5,3.75; 17 -0.7,3.75; 18 -1.9,3.75 | smd 1.5 x 0.8: 9 5.75,-1.8; 10 5.75,-0.6; 11 5.75,0.6; 12 5.75,1.8 | smd 0.8 x 0.8: B1 1.7,-1.8; B2 2.9,-1.8; B3 4.1,-1.8; B4 4.1,-0.6; B5 4.1,0.6; B6 4.1,1.8
TAG_TC2030-IDC-NL = smd 0.787 x 0.787: 1 -1.27,-0.635; 2 -1.27,0.635; 3 0,-0.635; 4 0,0.635; 5 1.27,-0.635; 6 1.27,0.635 | hole 0.991: -2.54,0; 2.54,1.016; 2.54,-1.016
SOT23-3 = smd 0.8 x 0.9: 1 -0.95,-1; 2 0.95,-1; 3 0,1.1
0603-RES = smd 1.1 x 1: 1 -0.85,0; 2 0.85,0
EXBV8V = smd 0.45 x 0.7: 1 -1.2,-0.775; 2 -0.4,-0.775; 3 0.4,-0.775; 4 1.2,-0.775; 5 1.2,0.775; 6 0.4,0.775; 7 -0.4,0.775; 8 -1.2,0.775
SOLDERJUMPER_ARROW_NOPASTE = smd 0.762 x 1.524: 1 -1.016,0; 2 1.016,0
MA03-1 = drill 1.016 long: 1 -2.54,0; 2 0,0; 3 2.54,0
LQFP100 = smd 0.9 x 0.3: 1 -7.72,6; 2 -7.72,5.5; 3 -7.72,5; 4 -7.72,4.5; 5 -7.72,4; 6 -7.72,3.5; 7 -7.72,3; 8 -7.72,2.5; 9 -7.72,2; 10 -7.72,1.5; 11 -7.72,1; 12 -7.72,0.5; 13 -7.72,0; 14 -7.72,-0.5; 15 -7.72,-1; 16 -7.72,-1.5; 17 -7.72,-2; 18 -7.72,-2.5; 19 -7.72,-3; 20 -7.72,-3.5; 21 -7.72,-4; 22 -7.72,-4.5; 23 -7.72,-5; 24 -7.72,-5.5; 25 -7.72,-6; 51 7.72,-6; 52 7.72,-5.5; 53 7.72,-5; 54 7.72,-4.5; 55 7.72,-4; 56 7.72,-3.5; 57 7.72,-3; 58 7.72,-2.5; 59 7.72,-2; 60 7.72,-1.5; 61 7.72,-1; 62 7.72,-0.5; 63 7.72,0; 64 7.72,0.5; 65 7.72,1; 66 7.72,1.5; 67 7.72,2; 68 7.72,2.5; 69 7.72,3; 70 7.72,3.5; 71 7.72,4; 72 7.72,4.5; 73 7.72,5; 74 7.72,5.5; 75 7.72,6 | smd 0.3 x 0.9: 26 -6,-7.72; 27 -5.5,-7.72; 28 -5,-7.72; 29 -4.5,-7.72; 30 -4,-7.72; 31 -3.5,-7.72; 32 -3,-7.72; 33 -2.5,-7.72; 34 -2,-7.72; 35 -1.5,-7.72; 36 -1,-7.72; 37 -0.5,-7.72; 38 0,-7.72; 39 0.5,-7.72; 40 1,-7.72; 41 1.5,-7.72; 42 2,-7.72; 43 2.5,-7.72; 44 3,-7.72; 45 3.5,-7.72; 46 4,-7.72; 47 4.5,-7.72; 48 5,-7.72; 49 5.5,-7.72; 50 6,-7.72; 76 6,7.72; 77 5.5,7.72; 78 5,7.72; 79 4.5,7.72; 80 4,7.72; 81 3.5,7.72; 82 3,7.72; 83 2.5,7.72; 84 2,7.72; 85 1.5,7.72; 86 1,7.72; 87 0.5,7.72; 88 0,7.72; 89 -0.5,7.72; 90 -1,7.72; 91 -1.5,7.72; 92 -2,7.72; 93 -2.5,7.72; 94 -3,7.72; 95 -3.5,7.72; 96 -4,7.72; 97 -4.5,7.72; 98 -5,7.72; 99 -5.5,7.72; 100 -6,7.72
USB_TYPE_C_DS_2 = smd 0.25 x 4: A1 2.75,-2.45; A4 1.25,-2.45; A9 -1.25,-2.45; A12 -2.75,-2.45 | smd 0.25 x 3.5: A2 2.25,-2.7; A3 1.75,-2.7; A5 0.75,-2.7; A6 0.25,-2.7; A7 -0.25,-2.7; A8 -0.75,-2.7; A10 -1.75,-2.7; A11 -2.25,-2.7 | smd 0.25 x 4 bottom: B1 -2.75,-2.45; B4 -1.25,-2.45; B9 1.25,-2.45; B12 2.75,-2.45 | smd 0.25 x 3.5 bottom: B2 -2.25,-2.7; B3 -1.75,-2.7; B5 -0.75,-2.7; B6 -0.25,-2.7; B7 0.25,-2.7; B8 0.75,-2.7; B10 1.75,-2.7; B11 2.25,-2.7
CRYSTAL-2.5X2.0 = smd 1 x 0.9: 1 -0.95,-0.8; 2 0.9,-0.8; 3 0.9,0.75; 4 -0.95,0.75

### Placement (x,y rotation side)
C1  68.53,36.68 90 bottom
C2  62.94,14.43 0 bottom
C3  68.38,9.19 90 bottom
C4  73.93,10.49 0 bottom
C5  73.92,11.97 0 bottom
C6  73.93,13.45 0 bottom
C7  71.74,3.8 0 bottom
C8  70.71,10.55 180 bottom
C9  70.71,12.04 180 bottom
C10  49.76,7.19 0 top
C11  64.43,46.3 270 bottom
C12  68.37,6.29 270 bottom
C13  70.71,13.51 180 bottom
C14  62.37,43.57 270 top
C16  68.93,43.37 90 top
C17  67.07,43.32 90 top
C18  67.61,41.31 0 top
C19  65.61,43.33 90 top
C20  64.11,43.33 90 top
C21  76.11,42.4 90 top
C22  65.2,45.41 180 top
C40  72.48,42.89 270 bottom
C41  67.37,42.87 270 bottom
C44  65.64,6.24 0 bottom
C48  60.37,33.32 270 bottom
C49  60.72,14.77 270 bottom
CONVERTER  65.99,9.1 0 bottom
GND  61.86,51.56 180 top
IMAGE_SENSOR  67.94,25.63 90 top
J1  54.84,8.08 0 top
JP4  74.38,48.59 180 bottom
L1  73.93,9 0 bottom
L3  66.08,12.36 90 bottom
L4  61.2,37.48 270 top
LED1  75.41,37.54 0 top
LED2  70.66,36.57 0 top
LED3  70.67,38.42 180 top
LED4  73.41,41.37 90 top
LED5  73.47,46.4 270 top
LIPOCHARGER  69.16,47.61 180 top
MOD1  65.74,6.34 90 top
PROGRAMMING_PINS  74.9,8.35 270 top
Q1  65.06,37.47 270 top
R1  67.54,37.55 90 top
R2  62.71,37.44 90 top
R3  73.38,43 0 top
R4  73.38,44.75 0 top
R5  62.33,12.13 270 bottom
R6  62.88,47.44 0 top
R7  62.89,49.26 0 top
R10  63.84,12.14 270 bottom
REGULATOR  70.98,7.27 180 bottom
RN1  75.6,35.91 180 bottom
RN3  71.02,36.46 0 bottom
RN4  66.07,36.47 180 bottom
SJ1  59.72,48.09 270 top
SV1  59.37,8.51 90 top
U1  68.2,25.25 0 bottom
USBC-CONNECTOR  71.69,49.9 180 top
VBAT  63.47,51.56 180 top
Y1  69.68,42.99 180 bottom

### Tracks (layer width: path | path; a pad name or v marks a point on that pad's centre or on a via)
BOOT0
  Bottom 0.152: RN3.3 70.62,35.1 70.97,34.75 71.1,34.49 71.74,34.49 71.86,34.37 71.86,33.64 U1.94 71.23,33.01
DCMI_CLK  (via drill 0.25)
  Top 0.152: v62.46,27 63.57,27 IMAGE_SENSOR.A5
  Bottom 0.152: U1.67 62.09,27.25 v62.46,27
DCMI_D0  (via drill 0.25)
  Top 0.152: v62.59,25.35 63.51,25.35 63.79,25.6 64.75,25.6 65,25.86 65,26.57 IMAGE_SENSOR.A6
  Bottom 0.152: U1.63 62.49,25.25 v62.59,25.35
DCMI_D1  (via drill 0.25)
  Top 0.152: 65.39,27.13 IMAGE_SENSOR.B6 64.94,27.64 64.01,27.64 63.46,28.19 v63,28.19
  Bottom 0.152: v63,28.19 63.02,26.52 62.24,25.86 60.58,25.86 U1.64
DCMI_D2  (via drill 0.25)
  Top 0.152: IMAGE_SENSOR.A7 64.38,28.13 58.96,33.6 58.96,36.78 v59.8,37.47 | v65.11,40.59 65.31,40.26 v69.37,40.26 | v72.17,34.7 72.22,34.52 73.62,33.3 74.28,33.3 74.53,33.55 v74.53,34.11
  Bottom 0.152: v59.8,37.47 59.8,37.92 61.68,39.78 61.78,39.88 64.62,39.88 64.9,40.46 v65.11,40.59 | v74.53,34.11 74.1,34.62 73.79,34.98 73.77,39.32 72.83,39.88 69.86,39.88 v69.37,40.26 | U1.97 72.68,33.5 72.17,34.01 v72.17,34.7
DCMI_D3  (via drill 0.25)
  Top 0.152: IMAGE_SENSOR.A8 64.15,29.13 63,30.28 v63,30.38 | v66.02,31.7 66.48,31.7 v67.29,30.56 | v69.2,30.56 69.45,30.81 69.58,30.81 v70.21,30.56 | v71.68,30.56 71.68,31.6 v71.76,31.83
  Bottom 0.152: v67.29,30.56 67.29,30.43 67.67,30.05 68.81,30.05 v69.2,30.56 | v70.21,30.56 v71.68,30.56 | v71.76,31.83 73.18,31.83 73.26,32 73.26,32.91 U1.98 | v66.02,31.7 65.82,31.7 65.54,31.42 64.17,31.39 63.66,30.33 63.05,30.33 v63,30.38
DCMI_D4  (via drill 0.33)
  Top 0.152: 74.28,29.92 v74.53,30.18 73.74,29.39 73.74,28.47 73.36,27.89 72.01,27.89 71.76,27.64 71.3,27.64 70.97,27.38 70.95,27 70.69,26.64 70.21,26.64 69.55,25.98 67.8,25.98 67.52,26.31 66.25,26.31 66.02,26.49 66.02,27.8 IMAGE_SENSOR.B7
  Bottom 0.152: v74.53,30.18 U1.3
DCMI_D5  (via drill 0.33)
  Top 0.152: v75.24,32.74 77.2,34.47 78.85,34.47 79.1,34.24 79.1,32.08 78.5,31.09 78.5,24.52 77.96,23.98 77.96,20.17 77.53,19.89 69.11,19.89 68.44,20.41 IMAGE_SENSOR.E1
  Bottom 0.152: U1.92 70.21,32.08 71.02,31.34 72.95,31.34 73.46,30.91 74.66,30.91 74.86,31.29 74.86,32.36 v75.24,32.74
DCMI_D6  (via drill 0.33)
  Top 0.152: v74.38,28.91 74.86,28.58 74.86,20.57 74.04,20.24 70.05,20.24 69.44,20.53 IMAGE_SENSOR.F1
  Bottom 0.152: v74.38,28.91 74.38,29.29 74.91,29.67 75.83,29.67 U1.4
DCMI_D7  (via drill 0.25)
  Top 0.152: IMAGE_SENSOR.F2 69.89,22.61 70.72,22.61 70.95,22.94 70.95,23.32 71.15,23.62 73.84,23.62 73.87,23.65 v74.17,23.65
  Bottom 0.152: U1.5 75.26,29.25 74.86,29.11 74.86,28.35 73.59,26.77 73.59,25.1 74.22,24.71 v74.17,23.65
DCMI_HSYNC  (via drill 0.25)
  Top 0.152: IMAGE_SENSOR.H2 72.81,23.13 v73.01,22.94
  Bottom 0.152: v73.01,22.94 73.01,18.87 73.26,18.62 73.26,17.6 U1.28
DCMI_PCLK  (via drill 0.25)
  Top 0.152: v67.16,25.73 65.64,25.73 IMAGE_SENSOR.B5
  Bottom 0.152: U1.30 72.12,20.65 72.12,24.56 70.95,25.73 v67.16,25.73
DCMI_PWDN  (via drill 0.25)
  Top 0.152: IMAGE_SENSOR.F8 69.45,29.54 v68.31,30.68
  Bottom 0.152: RN4.7 65.67,34.84 66.99,33.66 68.05,33.66 68.2,33.51 U1.88 68.2,32.25 67.93,31.98 67.93,31.06 v68.31,30.68
DCMI_RST  (via drill 0.25)
  Top 0.152: IMAGE_SENSOR.G8 69.97,28.65 69.2,28.65 68.94,28.91 68.94,29.23 68.05,30.18 67.8,30.43 67.8,30.96 67.65,31.12 67.32,31.12 66.81,31.83 66.81,32.69 v65.06,34.44
  Bottom 0.152: U1.69 60.46,28.27 60.08,28.22 59.7,28.55 59.7,30.1 58.6,30.56 58.6,31.85 59.26,32.56 59.26,35.03 59.7,35.46 59.9,35.69 RN4.8 64.87,35.64 64.88,35.64 64.88,34.87 v65.06,34.44
DCMI_VSYNC  (via drill 0.25)
  Top 0.152: IMAGE_SENSOR.G2 70.44,23.17 70.95,23.8 70.95,24.38 71.25,24.64 71.86,24.64 72.75,25.48 v72.75,25.86 | v70.72,33.98 71.94,33.98 72.24,33.73 72.62,33.43 v72.57,30.58
  Bottom 0.152: 72.62,30.43 v72.57,30.58 72.75,30.3 v72.75,25.86 | v70.72,33.98 70.72,33 U1.93
GND  (via drill 0.25, 0.33)  (19 unrouted)
  Top 0.152: USBC-CONNECTOR.B9 70.47,52.33 70.47,50.5 70.4,50.43 70.4,49.99 70.21,49.78 69.32,49.78 69.16,49.64 69.16,49.51 | 66.44,23.99 IMAGE_SENSOR.C3 66.44,23.77 66.3,23.62 66.1,23.62 65.94,23.47 65.94,22.66 IMAGE_SENSOR.B1 | v77.22,22.2 77.2,22.43 77.2,26.37 77.02,26.64 v76.94,26.75 77.55,27.2 77.55,29.41 75.52,31.04 74.4,31.06 74.17,31.29 | 62.71,35.14 v62.72,34.95 R2.1 64,36.59 Q1.2 64.06,37.23 v65,38.18 | v70.97,2.59 70.97,2.24 70.72,1.98 69.6,1.98 69.47,2.11 69.47,3.22 MOD1.2 | LIPOCHARGER.2 69.16,49.51 | 69.16,49.51 68.83,49.78 67.94,49.78 v67.01,51.13 | IMAGE_SENSOR.C7 IMAGE_SENSOR.C6 67.1,27.13 v67.29,27.38 | IMAGE_SENSOR.F3 68.74,24.13 v68.69,24.08 | PROGRAMMING_PINS.5 71.78,7.08 70.97,6.27 v70.97,5.16 | 74.17,31.29 73.89,31.57 v73.89,31.7 | 74.17,31.29 73.51,30.63 73.51,28.52 73.26,28.14 73.24,28.13 IMAGE_SENSOR.H7 70.75,27.64 70.21,27.64 69.7,27.13 IMAGE_SENSOR.F6 69.19,27.38 v68.56,27.38 | v73.13,14.73 74.53,16.13 v75.09,16.13 | R6.2 64.24,47.03 64.3,47.03 65.07,47.03 66.07,47.02 66.38,47.32 v66.38,47.58
  Top 0.406: LED5.C 75.04,46.4 75.04,45.92
  Bottom 0.152: C13.2 71.51,13.94 | v70.97,5.16 70.72,4.9 70.72,4.02 C7.2 70.94,2.4 v70.97,2.59 | U1.10 v76.94,26.75 | v77.22,22.2 76.94,22.17 75.99,22.17 U1.19 | 61.19,32.59 61.42,32.74 61.42,34.44 61.93,34.95 v62.72,34.95 | 61.19,32.59 60.43,32.59 C48.2 | U1.74 61.14,30.75 61.42,31.06 61.42,32.33 61.19,32.59 | C8.2 71.51,9.17 REGULATOR.2 | R5.1 62.28,13.03 61.58,13.03 60.72,13.89 C49.2 61.18,14.43 C2.2 | C2.2 62.08,14.43 61.96,14.43 | C12.1 68.37,7 67.54,6.28 67.48,6.22 67.46,6.24 C44.1 66.49,6.28 66.49,7.53 CONVERTER.2 | 74.2,17.5 U1.26 74.21,17.55 74.76,17.55 75.09,17.22 v75.09,16.13 | v73.13,14.73 72.75,14.28 72.75,13.83 C6.2 | U1.49 62.7,16.61 62.85,16.46 62.85,15.95 62.08,15.19 62.08,14.47 C2.2 | v67.01,51.13 65.39,51.13 64.95,50.7 64.37,50.11 C11.C 65.17,47.97 65.98,47.97 v66.38,47.58 | v67.29,27.38 67.98,27.38 | 67.98,27.38 v68.56,27.38 | v65,38.18 65.39,38.18 65.51,38.05 65.51,37.4 RN4.2 | v68.69,24.08 68.69,24.59 68.05,25.22 66.78,25.22 66.5,25.63 66.5,26.26 66.81,26.47 67.67,26.49 67.95,26.77 arc90 67.98,26.8 67.98,27.38 | C1.2 68.92,39.24 70.29,39.24 70.62,37.89 RN3.6 70.62,37.7 71.1,38.18 72.12,38.18 72.75,37.41 72.73,34.14 73.7,33.42 U1.99 73.7,31.9 v73.89,31.7
  Bottom 0.254: 68.38,7.2 C12.1 | 70.92,8.58 REGULATOR.2
  pour Bottom: 57.38,53.42 79.48,53.42 79.48,0.2 68.31,0.2 68.31,5.03 57.38,5.03
GPIOB1  (1 unrouted)
GPIOB2
  Top 0.152: SV1.2 60.35,8.51 60.8,8.52 60.99,8.92 60.99,9.63 61.09,9.83 63.23,9.83 63.84,10.44 MOD1.B6
LED_B
  Bottom 0.152: RN1.6 76.05,34.72 79.1,31.57 79.11,24.46 78.78,23.83 77.15,23.83 76.69,23.32 75.98,23.32 U1.17
LED_G
  Bottom 0.152: U1.16 75.99,23.83 76.69,23.83 77.09,24.08 78.62,24.08 78.85,24.46 78.85,31.45 75.88,34.52 75.37,34.52 RN1.7
LED_IR  (via drill 0.33)
  Top 0.152: v77.7,33.86 77.7,33.6 v76.05,32.08
  Bottom 0.152: RN1.5 76.78,34.84 v77.7,33.86 | v76.05,32.08 76.05,31.39 U1.1
LED_R
  Bottom 0.152: U1.15 76,24.33 78.39,24.33 78.59,24.64 78.59,31.32 76,34.04 75.8,34.24 75.29,34.24 74.96,34.57 74.81,34.57 RN1.8
N$1
  Top 0.152: 72.36,42.93 LED4.C
  Top 0.254: 72.36,42.93 R3.1
N$2  (via drill 0.25)
  Top 0.152: v77.96,31.14 78.72,32.21 78.72,33.05 v78.54,33.22
  Bottom 0.152: Y1.3 70.58,42.09 C40.2 72.59,41.99 78.34,41.99 78.59,41.73 v78.54,33.22 | U1.13 77.1,25.25 78.21,26.37 78.21,30.56 v77.96,31.14
N$3  (via drill 0.33)
  Top 0.152: R3.2 | R3.2 R4.2 74.75,45.16 v75.88,45.16 | LIPOCHARGER.1 70.4,48.91 v71.25,48.91
  Bottom 0.152: v71.25,48.91 v71.25,48.9 74.43,48.9 75.88,47.45 v75.88,45.16
N$4
  Bottom 0.152: Y1.1 67.13,42.2 C41.2 67.54,41.66 67.54,40.84 68.28,39.65 72.73,39.65 73.54,39.19 73.54,34.98 74,34.42 74,33.86 74.25,33.6 74.91,33.6 75.27,34.01 75.7,34.01 75.72,33.98 77.5,32.11 77.45,31.57 77.3,31.42 77.3,30.91 77.83,30.56 77.83,26.49 77.09,25.75 U1.12
N$5  (via drill 0.33)
  Top 0.152: R2.2 62.84,38.42 Q1.1 64.06,38.89 64.62,39.45 73.64,39.45 74.28,40.46 77.83,40.46 78.42,39.47 78.42,38.07 v77.96,37.03
  Bottom 0.152: v77.96,37.03 77.15,37.03 RN1.4
N$6  (via drill 0.25)
  Top 0.152: v76.49,37.64 77.2,37.54 77.2,36.62 76.23,35.91 LED1.B
  Bottom 0.152: RN1.3 76,37.24 v76.49,37.64
N$7  (1 unrouted)
N$8  (via drill 0.33)
  Top 0.152: LED1.R 74.58,39.37 75.04,40.21 77.2,40.21 v77.83,39.19
  Bottom 0.152: RN1.1 74.53,36.81 74.53,37.41 74.78,38.28 77.3,38.28 77.7,38.68 77.7,39.07 v77.83,39.19
N$9  (via drill 0.25)
  Top 0.152: LED1.G 74.65,36.96 v75.19,37.64
  Bottom 0.152: v75.19,37.64 75.42,37.41 75.42,36.9 RN1.2
N$10
  Top 0.152: R1.2 69.04,38.4 LED3.C
N$11
  Bottom 0.152: C7.1 72.54,5.58 REGULATOR.4
N$12  (via drill 0.33)
  Top 0.152: v76.23,14.12 v76.21,15.7
  Bottom 0.152: U1.20 U1.21 75.96,21.26 76.49,21.26 76.71,20.98 76.71,16.2 v76.21,15.7 | L1.1 C4.1 C5.1 75.77,12.01 76.22,12.71 v76.23,14.12
N$13
  Bottom 0.152: R5.2 63.64,11.34 R10.2 63.84,10.84 CONVERTER.4
N$14
  Top 0.152: Q1.3 66.16,37.4 66.78,36.78 67.46,36.78 R1.1
N$15  (via drill 0.33)
  Top 0.152: R6.1 61.35,47.05 SJ1.2 59.74,47.05 60.51,46.21 60.73,46 61.73,45.99 62.49,45.67 v62.25,45.71 | 70.11,46.08 LIPOCHARGER.5 70.11,45.72 69.78,45.39 v69.13,45.39
  Bottom 0.152: v69.13,45.39 67.67,45.41 66.75,46.56 63.45,46.56 v62.25,45.71
N$16
  Top 0.152: LED5.A 72.43,46.4 R4.1
N$17  (1 unrouted)
N$18
  Top 0.152: SJ1.1 61.32,49.1 R7.1
N$19  (via drill 0.25)
  Top 0.152: IMAGE_SENSOR.G7 70.97,28.65 71.66,28.65 72.14,28.88 72.14,29.36 71.84,29.67 71.53,29.67 71.43,29.82 71.28,30.07 71.18,30.28 69.2,34.14 v69.2,34.75
  Bottom 0.152: RN4.5 67.27,35.15 67.42,35 68.94,35 v69.2,34.75
N$20  (via drill 0.25)
  Top 0.152: IMAGE_SENSOR.H8 70.47,31 68.66,34.42 68.36,34.72 v66.66,34.72
  Bottom 0.152: RN4.6 66.5,35.01 v66.66,34.72
N$21  (1 unrouted)
NRST  (via drill 0.25)
  Top 0.152: v70.14,34.72 71.46,34.72 77.78,29.54 v77.77,25.16
  Bottom 0.152: C1.1 68.72,35.69 RN3.4 69.82,34.88 v70.14,34.72 | v77.77,25.16 77.32,24.84 76,24.84 U1.14
P$1  (1 unrouted)
RAW  (via drill 0.25)
  Top 0.152: 67.54,48.72 67.1,48.46 67.1,46.18 66.52,45.41 C22.1 66.78,44.78 69.58,44.78 70.14,44.27 70.14,40.11 69.65,39.75 60.84,39.75 58.38,37.52 58.38,30.89 60.38,29.39 60.33,18.72 60.33,17.75 61.09,16.99 64.8,16.99 66.06,15.52 66.94,15.52 68.17,14.29 68.17,13.9 v68.31,13.77 | 67.54,48.72 68.03,48.72 LIPOCHARGER.3 | VBAT.1 65.43,51.57 67.11,49.73 67.11,49 67.54,48.72
  Bottom 0.152: C44.2 64.74,6.7 64.79,7.55 CONVERTER.3 65.04,8.75 65.39,9.09 66.69,9.09 66.94,8.84 | CONVERTER.1 66.94,8.84 | 66.94,8.84 66.94,9.13 67.48,9.67 67.48,10.68 67.8,11 68.2,11 68.31,11.1 v68.31,13.77
RESETB
  Top 0.152: MOD1.6 73.63,8.04 73.74,8.15 74.07,8.15 PROGRAMMING_PINS.3
SPI3_MISO  (via drill 0.25)
  Top 0.152: v73.26,24.51 72.98,24.21 71.52,24.21 IMAGE_SENSOR.H3
  Bottom 0.152: U1.90 69.2,31.83 69.83,31.09 72.88,31.09 73.34,30.68 73.34,24.59 v73.26,24.51
SPI3_MOSI  (via drill 0.25)
  Top 0.152: IMAGE_SENSOR.G3 70.42,24.13 69.83,24.71 v67.67,24.71 | v67.93,34.11 67.72,33.91 67.72,32.46 68.48,31.7 v68.69,31.7
  Bottom 0.152: v67.67,24.71 67.04,24.21 66.38,24.21 66.02,24.56 66.02,29.03 66.81,29.82 69.42,29.82 69.6,30 69.6,30.79 v68.69,31.7 | U1.91 69.68,32.99 69.68,33.78 69.35,34.11 v67.93,34.11
SPI3_SSEL  (via drill 0.25)
  Top 0.152: 63.1,31.7 v62.72,31.7 64.06,31.7 64.93,30.84 64.93,28.98 65.26,28.63 67.77,28.63 67.98,28.42 67.98,27.99 67.87,27.84 67.87,26.77 67.85,26.75 68.13,26.44 69.45,26.44 70.16,27.13 IMAGE_SENSOR.G6
  Bottom 0.152: U1.77 62.7,31.72 v62.72,31.7
SW
  Bottom 0.152: CONVERTER.5 66.94,12.22 L3.1
SWDCLKB
  Top 0.152: PROGRAMMING_PINS.4 75.7,8.51 76.03,8.51 76.21,8.33 76.21,7.56 77.09,6.22 77.09,3.66 77.04,3.58 76.41,2.95 71.66,2.95 71.23,4.24 70.97,4.27 69.65,4.27 69.49,4.42 MOD1.4
SWDIO  (via drill 0.25)
  Top 0.152: PROGRAMMING_PINS.2 78.23,9.62 78.72,10.31 78.72,15.98 75.27,19.53 63.15,19.53 62.39,20.29 62.39,23.95 61.91,24.44 v61.91,28.98
  Bottom 0.152: v61.91,28.98 61.91,29.54 61.68,29.79 60.52,29.79 U1.72
UART2_RX  (via drill 0.25)  (1 unrouted)
  Top 0.152: v65.64,18.87 65.64,17.35 v66.4,16.4 | MOD1.14 62,7.82 61.45,7.82 61.47,7.85 64.34,7.85 64.45,8 64.5,8.1 64.54,8.67 64.53,13.95 64.87,14.34 v65.56,14.34
  Bottom 0.152: v65.64,18.87 63.89,21.56 63.86,29.67 64.43,30.94 67.23,30.94 67.68,31.52 67.68,31.56 U1.87 | v65.56,14.34 66.05,14.35 66.45,15.01 v66.4,16.4
UART2_TX  (via drill 0.25)
  Top 0.152: v60.53,12.65 60.95,12.34 61.26,12.14 61.25,11.05 61.85,10.44 MOD1.13
  Bottom 0.152: v60.53,12.65 60.08,12.93 59.67,13.28 59.67,16.59 63.61,21.54 63.61,29.67 64.31,31.19 67.11,31.19 67.44,31.6 67.44,32 67.2,32.25 U1.86 | 67.16,32.94 U1.86 | 67.16,32.69 U1.86 | U1.86
VAA  (via drill 0.25)
  Top 0.152: C19.1 C20.1 C14.2 62.65,41.53 v62.64,41.45 | v59.9,36.55 60.87,36.55 61.1,36.65 L4.2 61.19,36.55 61.17,35.13 65.47,30.78 IMAGE_SENSOR.B8 IMAGE_SENSOR.C8 66.75,29.13 67.24,29.62 67.75,29.62 67.98,29.23 67.98,28.85 68.18,28.65 68.67,28.65 69.19,28.13 IMAGE_SENSOR.F7
  Bottom 0.152: v59.9,36.55 59.26,37.21 59.26,37.95 61.22,39.95 v62.64,41.45
VBAT  (via drill 0.25)
  Top 0.152: 68.15,42.68 C17.1 65.59,41.61 v65.13,41.61 | 68.15,42.68 C16.1 | v62.21,16.2 63.96,16.2 64.24,15.93 v64.24,15.67 | v74.2,26.26 73.13,27.13 IMAGE_SENSOR.H6 70.95,26.51 70.92,25.91 70.67,25.65 70.01,25.65 69.58,25.37 67.65,25.37 67.06,24.97 67.06,24.33 67.37,23.93 67.87,23.93 68.37,23.13 IMAGE_SENSOR.E2 67.93,22.55 67.93,21.79 67.67,21.41 65.26,21.41 64.95,21.82 64.95,24.69 65.03,24.79 65.28,24.79 IMAGE_SENSOR.B4 IMAGE_SENSOR.A4 | IMAGE_SENSOR.A4 64.44,25.02 | v63.86,20.32 64.43,20.85 IMAGE_SENSOR.A1 63.89,22.79 63.89,24.69 64.01,24.82 64.28,24.82 IMAGE_SENSOR.A4 | LED2.A 70.04,36.57 70.15,36.46 | 70.15,36.46 71.48,35.13 72.62,35.13 | 72.62,35.13 73.13,35.64 73.13,36.91 74.12,38.12 75.22,38.12 LED1.A | v61.83,23.44 61.07,23.39 60.92,23.8 60.89,23.83 60.89,29.79 59.34,30.96 v59.34,31.25 | 72.62,35.13 v73.41,34.26 | v69.96,38.3 70.59,38.3 70.72,38.18 70.72,37.03 70.15,36.46 | v62.9,24.41 63.51,25.13 IMAGE_SENSOR.A4 | 68.15,42.68 68.51,42.08 C18.2
  Bottom 0.152: L1.2 73.13,8.72 | RN4.3 RN4.4 RN3.5 69.82,38.17 v69.96,38.3 | 60.75,31.25 U1.75 60.23,31.25 v59.34,31.25 | C3.2 69.44,10.09 C8.1 | C8.1 C9.1 C13.1 69.81,13.51 68.87,14.45 68.15,14.45 67.34,13.64 65.39,13.64 65.18,13.44 L3.2 64.45,12.99 R10.1 C2.1 63.85,15.17 v64.24,15.67 | C8.1 70.1,10.36 REGULATOR.1 70.1,8.18 70.68,7.27 71.57,7.27 71.99,7.95 71.99,8.7 REGULATOR.3 | L1.2 72.29,9.01 REGULATOR.3 | L1.2 73.47,8.1 76.26,8.1 76.59,8.56 76.59,13.54 76.94,13.99 76.94,14.61 76.69,14.76 74.99,14.76 74.73,14.61 | C6.1 74.73,14.61 | 74.73,14.61 74.73,15.62 73.77,16.59 73.77,17.46 U1.27 | v62.21,16.2 62.08,16.46 62.08,17.42 U1.50 62.2,18.73 v63.86,20.32 | 71.99,9.35 71.99,8.73 REGULATOR.3 | RN4.3 66.53,37.31 66.53,39.98 v65.13,41.61 64.52,42.24 C11.A | v61.83,23.44 v62.9,24.41 | v73.41,34.26 74.15,33.35 U1.100 74.45,33.22 75.67,33.22 76.94,31.95 76.94,29.29 76.41,28.75 U1.6 76.84,28.75 77.58,28.4 77.58,26.62 77.2,26.24 75.93,26.24 U1.11 74.21,26.25 v74.2,26.26 | RN4.1 64.87,36.78 65.13,36.53 66.15,36.53 66.4,36.78 66.4,37.17 RN4.3
  Bottom 0.254: 72.88,8.76 L1.2
VCAP1  (via drill 0.25)
  Top 0.152: v61.42,17.88 62.27,18.87 62.43,19.02 63.07,19.02 v63.21,18.88 v63.21,18.87
  Bottom 0.152: C49.1 60.72,17.12 v61.42,17.88 | 63.23,17.56 U1.48 63.21,17.55 v63.21,18.87
  Bottom 0.254: U1.48
VCAP2
  Bottom 0.152: U1.73 59.97,30.25 58.83,30.71 58.83,31.78 59.52,32.46 59.52,33.66 59.99,34.12 C48.1 60.36,34.11
VCC
  Top 0.152: PROGRAMMING_PINS.1 73.24,9.11 72.14,9.09 69.62,9.09 69.49,9.22 MOD1.8
VDD
  Top 0.152: 74.53,41.37 LED4.A 76.11,41.37 C21.1 76.78,41.45 77.26,41.92 77.26,46.6 76.61,47.37 74.21,47.37 JP4.1 | LIPOCHARGER.4 68.21,46.72 68.94,47.45 72.22,47.45 JP4.1 | USBC-CONNECTOR.B1 74.44,49.67 JP4.1
VDDA  (via drill 0.33)
  Top 0.152: v77.17,15.44 77.22,16.1 76.59,16.74 67.24,16.74 66.78,15.82 66.12,15.82 64.89,17.27 61.12,17.27 60.58,17.8 60.58,18.72 60.64,29.54 58.65,31.01 58.65,37.41 59.98,38.48 60.69,38.51 L4.1
  Bottom 0.152: C12.2 69.38,5.39 REGULATOR.5 70.1,2.72 70.52,1.93 71.48,1.93 72.04,2.62 76.54,2.62 77.35,3.43 77.35,6.27 76.43,7.65 76.43,7.95 76.84,8.51 76.84,13.44 77.2,13.89 77.2,14.71 v77.17,15.44